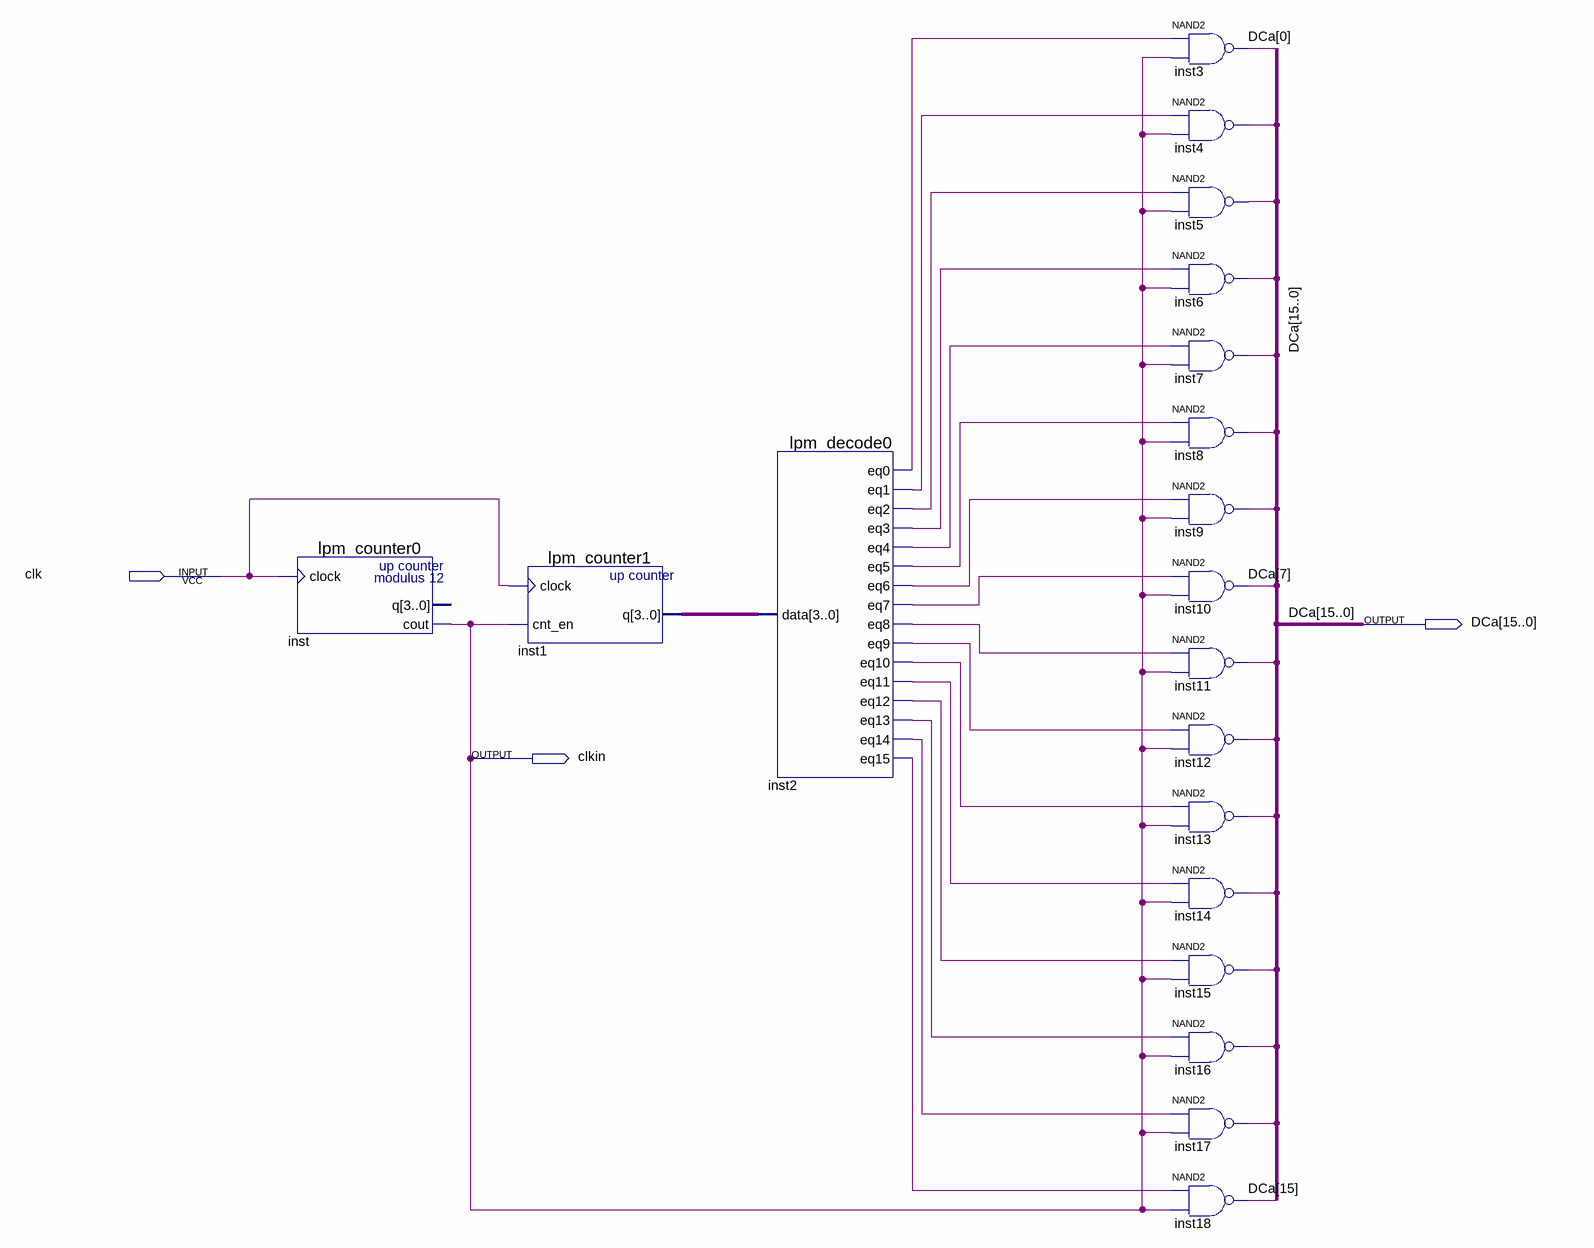
[diagram p0: schematic sheet]
// Quartus schematic oporsig.bdf as structural Verilog: 19 symbols, 3 pins
module oporsig (
  input  clk,
  output [15:0] DCa,
  output clkin
);

  wire inst2_eq0, inst2_eq1, inst2_eq2, inst2_eq3, inst2_eq4, inst2_eq5, inst2_eq6, inst2_eq7, inst2_eq8,
       inst2_eq9, inst2_eq10, inst2_eq11, inst2_eq12, inst2_eq13, inst2_eq14, inst2_eq15;
  wire [3:0] inst1_q;

  lpm_counter0 inst (.clock(clk), .cout(clkin));  // open: q
  lpm_counter1 inst1 (.clock(clk), .cnt_en(clkin), .q(inst1_q));
  lpm_decode0 inst2 (
    .data(inst1_q), .eq0(inst2_eq0), .eq1(inst2_eq1), .eq2(inst2_eq2), .eq3(inst2_eq3), .eq4(inst2_eq4),
    .eq5(inst2_eq5), .eq6(inst2_eq6), .eq7(inst2_eq7), .eq8(inst2_eq8), .eq9(inst2_eq9), .eq10(inst2_eq10),
    .eq11(inst2_eq11), .eq12(inst2_eq12), .eq13(inst2_eq13), .eq14(inst2_eq14), .eq15(inst2_eq15));
  nand inst3 (DCa[0], inst2_eq0, clkin);
  nand inst4 (DCa[1], inst2_eq1, clkin);
  nand inst5 (DCa[2], inst2_eq2, clkin);
  nand inst6 (DCa[3], inst2_eq3, clkin);
  nand inst7 (DCa[4], inst2_eq4, clkin);
  nand inst8 (DCa[5], inst2_eq5, clkin);
  nand inst9 (DCa[6], inst2_eq6, clkin);
  nand inst10 (DCa[7], inst2_eq7, clkin);
  nand inst11 (DCa[8], inst2_eq8, clkin);
  nand inst12 (DCa[9], inst2_eq9, clkin);
  nand inst13 (DCa[10], inst2_eq10, clkin);
  nand inst14 (DCa[11], inst2_eq11, clkin);
  nand inst15 (DCa[12], inst2_eq12, clkin);
  nand inst16 (DCa[13], inst2_eq13, clkin);
  nand inst17 (DCa[14], inst2_eq14, clkin);
  nand inst18 (DCa[15], inst2_eq15, clkin);
endmodule
